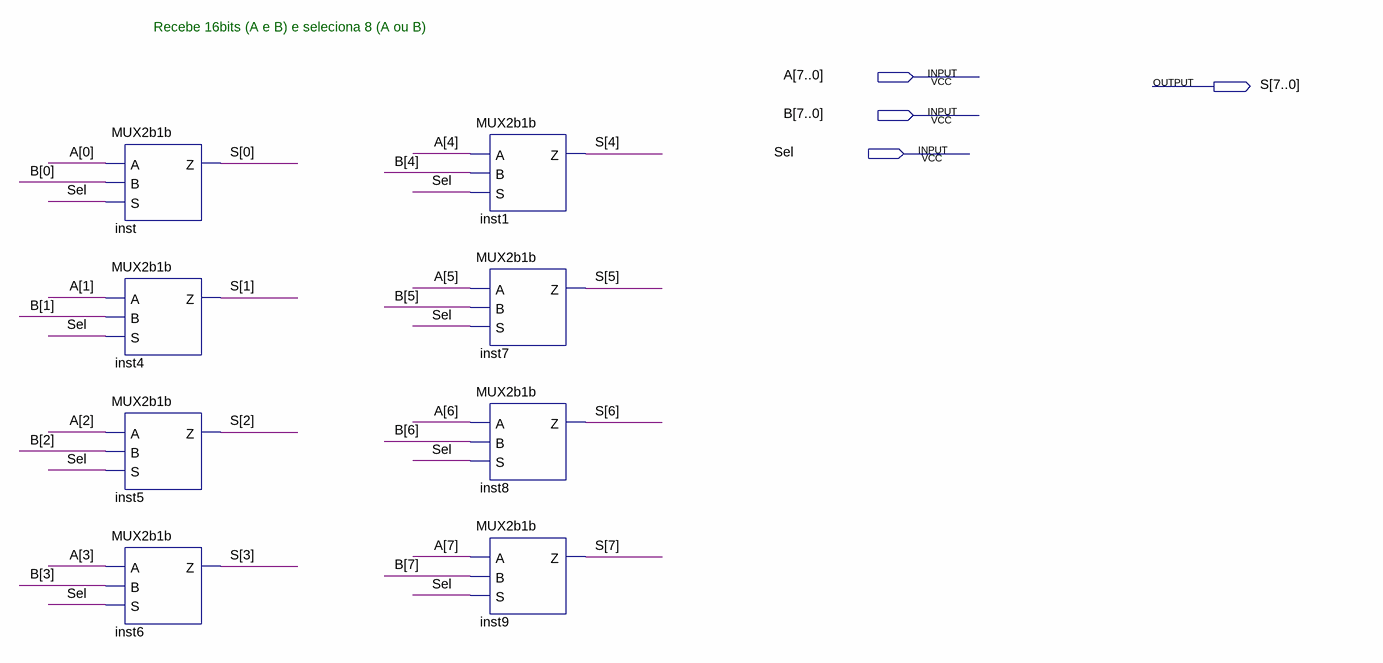
[diagram p0: schematic sheet]
// Quartus schematic MUX16b8b.bdf as structural Verilog: 8 symbols, 4 pins
module MUX16b8b (
  input  [7:0] A,
  input  [7:0] B,
  input  Sel,
  output [7:0] S
);

  MUX2b1b inst (.A(A[0]), .B(B[0]), .S(Sel), .Z(S[0]));
  MUX2b1b inst4 (.A(A[1]), .B(B[1]), .S(Sel), .Z(S[1]));
  MUX2b1b inst5 (.A(A[2]), .B(B[2]), .S(Sel), .Z(S[2]));
  MUX2b1b inst6 (.A(A[3]), .B(B[3]), .S(Sel), .Z(S[3]));
  MUX2b1b inst1 (.A(A[4]), .B(B[4]), .S(Sel), .Z(S[4]));
  MUX2b1b inst7 (.A(A[5]), .B(B[5]), .S(Sel), .Z(S[5]));
  MUX2b1b inst8 (.A(A[6]), .B(B[6]), .S(Sel), .Z(S[6]));
  MUX2b1b inst9 (.A(A[7]), .B(B[7]), .S(Sel), .Z(S[7]));

  // Notes on the sheet:
  //   Recebe 16bits (A e B) e seleciona 8 (A ou B)
endmodule
